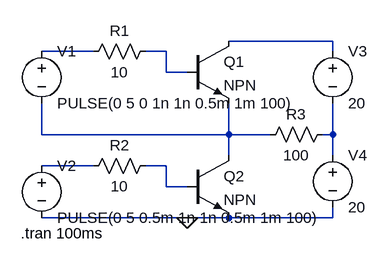
[diagram p0: schematic inverter_R.asc]
inverter_R.asc, the LTspice schematic file:
Version 4
SHEET 1 880 680
WIRE 352 48 192 48
WIRE -16 64 -96 64
WIRE 96 64 64 64
WIRE 352 64 352 48
WIRE 96 96 96 64
WIRE 128 96 96 96
WIRE -96 192 -96 144
WIRE 192 192 192 144
WIRE 192 192 -96 192
WIRE 256 192 192 192
WIRE 352 192 352 144
WIRE 352 192 336 192
WIRE 192 224 192 192
WIRE 352 224 352 192
WIRE -16 240 -96 240
WIRE 96 240 64 240
WIRE 96 272 96 240
WIRE 128 272 96 272
WIRE 128 320 -96 320
WIRE 192 320 128 320
WIRE 352 320 352 304
WIRE 352 320 192 320
FLAG 128 320 0
SYMBOL res 80 48 R90
WINDOW 0 0 56 VBottom 2
WINDOW 3 32 56 VTop 2
SYMATTR InstName R1
SYMATTR Value 10
SYMBOL res 80 224 R90
WINDOW 0 0 56 VBottom 2
WINDOW 3 32 56 VTop 2
SYMATTR InstName R2
SYMATTR Value 10
SYMBOL res 352 176 R90
WINDOW 0 0 56 VBottom 2
WINDOW 3 32 56 VTop 2
SYMATTR InstName R3
SYMATTR Value 100
SYMBOL voltage -96 48 R0
WINDOW 123 0 0 Left 0
WINDOW 39 0 0 Left 0
SYMATTR InstName V1
SYMATTR Value PULSE(0 5 0 1n 1n 0.5m 1m 100)
SYMBOL voltage -96 224 R0
WINDOW 123 0 0 Left 0
WINDOW 39 0 0 Left 0
SYMATTR InstName V2
SYMATTR Value PULSE(0 5 0.5m 1n 1n 0.5m 1m 100)
SYMBOL voltage 352 48 R0
WINDOW 123 0 0 Left 0
WINDOW 39 0 0 Left 0
SYMATTR InstName V3
SYMATTR Value 20
SYMBOL voltage 352 208 R0
WINDOW 123 0 0 Left 0
WINDOW 39 0 0 Left 0
SYMATTR InstName V4
SYMATTR Value 20
SYMBOL npn 128 48 R0
SYMATTR InstName Q1
SYMBOL npn 128 224 R0
SYMATTR InstName Q2
TEXT -128 344 Left 2 !.tran 100ms

The netlist it stands for:
* inverter_R.asc
R1 N003 N002 10
R2 N007 N006 10
R3 N005 N004 100
V1 N002 N004 PULSE(0 5 0 1n 1n 0.5m 1m 100)
V2 N006 0 PULSE(0 5 0.5m 1n 1n 0.5m 1m 100)
V3 N001 N005 20
V4 N005 0 20
Q1 N001 N003 N004 0 NPN
Q2 N004 N007 0 0 NPN
.model NPN NPN
.model PNP PNP
.lib standard.bjt
.tran 100ms
.backanno
.end